# Altium schematic sheet Sheet1.SchDoc (part 2 of 3)
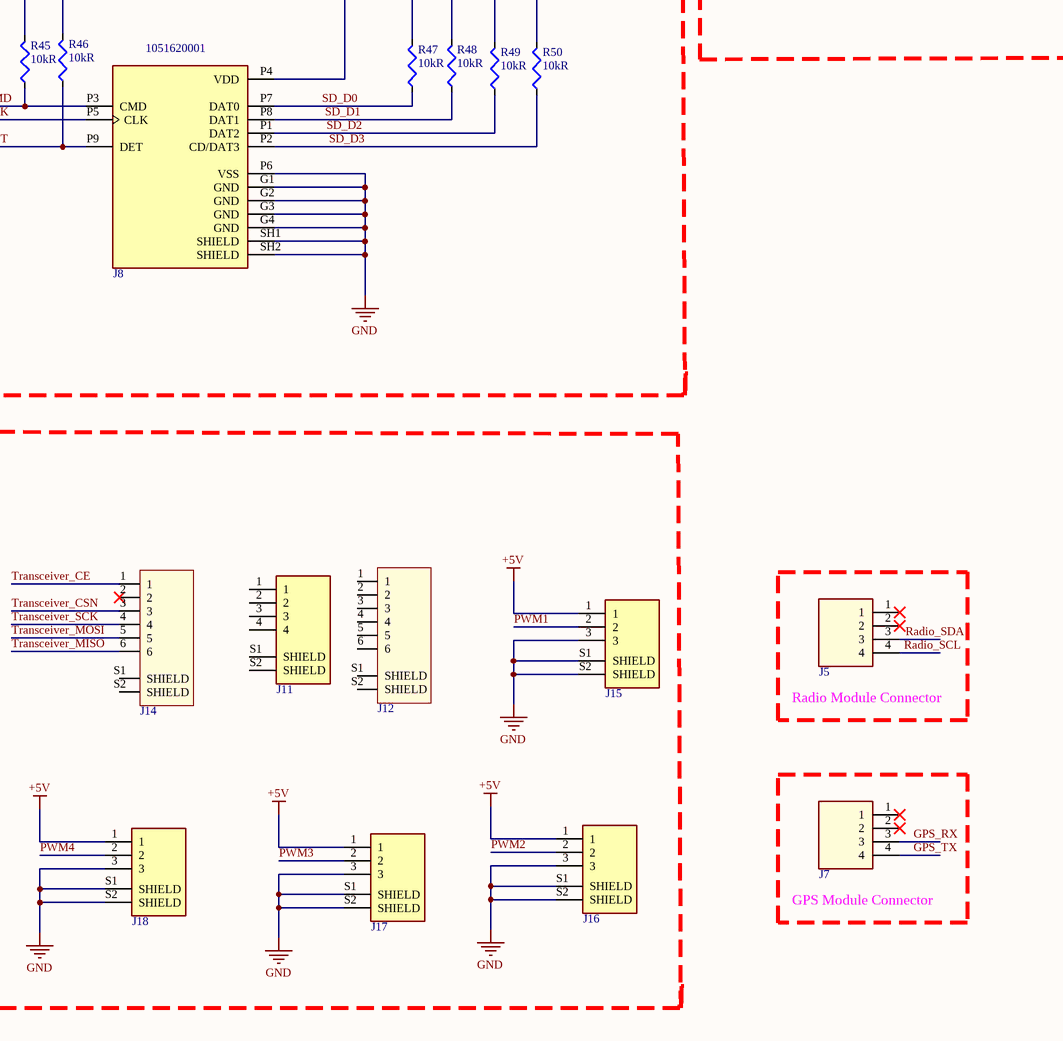
[diagram p4: Sheet1.SchDoc, bottom right]
## Library data of the parts
C1 C3 C29 C30 C52 C53 C64 = GRM155R71H103MA88D: Cap Ceramic 0.01uF 50V X7R 20% SMD 0402 125°C Paper T/R; Manufacturer: Murata; Supplier: Mouser; Supplier Part Number: 81-GRM155R71H103MA8D; Manufacturer Part Number: GRM155R71H103MA88D; RoHS: Yes; Category: Ceramic Capacitors; Stock: 64523; Pricing: 1=0.10000, 10=0.01200, 50=0.01200, 100=0.01000, 1000=0.00600, 10000=0.00400 (USD); Mounting Technology: Surface Mount; Case/Package: 0402; Min Operating Temperature: -55°C; Max Operating Temperature: 125°C; Tolerance: 20%; Packaging: Tape and Reel; Dielectric: X7R; Voltage Rating (DC): 50V; Construction: Flat; Length: 1mm; Width: 500um; Height: 0.5mm; Depth: 0.5mm; Thickness: 500um; Radiation Hardening: No; RoHS Compliant: Yes; ComponentLink1URL: https://datasheet.ciiva.com/11619/product-11619919.pdf?src-supplier=Avnet; ComponentLink1Description: https://datasheet.ciiva.com/11619/product-11619919.pdf?src-supplier=Avnet
C2 C7 C9 C27 C28 C31 C33 C37 C39 C44 C54 C55 = GCM155L81E104KE02D: 0402 0.1 uF 25 V ±10% Tolerance X8L Surface Mount Multilayer Ceramic Capacitor; Manufacturer: Murata; Supplier: Digi-Key; Supplier Part Number: 490-18203-6-ND; Manufacturer Part Number: GCM155L81E104KE02D; RoHS: Yes; Category: Ceramic Capacitors; Stock: 32810; Pricing: 1=0.10000, 10=0.04000, 50=0.02180, 100=0.01780, 500=0.01272, 1000=0.01000, 2500=0.00909, 5000=0.00836 (USD); RoHS Compliant: Yes; ComponentLink1URL: https://psearch.en.murata.com/capacitor/product/GCM155L81E104KE02%23.pdf?src-supplier=Digi-Key; ComponentLink1Description: https://psearch.en.murata.com/capacitor/product/GCM155L81E104KE02%23.pdf?src-supplier=Digi-Key; Case/Package: 0402
C4 C25 C26 C56 C57 = GRM152R60J105ME15D: Multilayer Ceramic Capacitor, 1 uF, 6.3 V, ± 20%, X5R, 0402 [1005 Metric]; Manufacturer: Murata; Material: 4241ConductorMaterial; Supplier: Mouser; Supplier Part Number: 81-GRM152R60J105ME5D; Manufacturer Part Number: GRM152R60J105ME15D; RoHS: Yes; Category: Ceramic Capacitors; Stock: 134223; Pricing: 1=0.2, 10=0.085, 50=0.085, 100=0.051, 1000=0.043, 10000=0.036 (USD); Height: 220um; ComponentLink1URL: http://search.murata.co.jp/Ceramy/image/img/A01X/G101/ENG/GRM152R60J105ME15-01.pdf?src-supplier=Digikey; ComponentLink1Description: http://search.murata.co.jp/Ceramy/image/img/A01X/G101/ENG/GRM152R60J105ME15-01.pdf?src-supplier=Digikey; ComponentLink2URL: https://datasheet.octopart.com/GRM152R60J105ME15D-Murata-datasheet-149522820.pdf?src-supplier=Newark; ComponentLink2Description: https://datasheet.octopart.com/GRM152R60J105ME15D-Murata-datasheet-149522820.pdf?src-supplier=Newark; ComponentLink3URL: https://datasheet.octopart.com/GRM152R60J105ME15D-Murata-datasheet-32479577.pdf?src-supplier=Future+Electronics; ComponentLink3Description: https://datasheet.octopart.com/GRM152R60J105ME15D-Murata-datasheet-32479577.pdf?src-supplier=Future+Electronics; Case/Package: 0402
C5 C6 = GCM1885C2A100JA16J: Multilayer Ceramic Capacitor, 10 pF, 100 V, ± 5%, C0G (NP0), 0603 [1608 Metric]; Manufacturer: Murata; Material: 4241ConductorMaterial; Voltage Rating: 100V; Temperature Coefficient: 30ppm/°C; Supplier: Mouser; Supplier Part Number: 81-GCM1885C2A100JA6J; Manufacturer Part Number: GCM1885C2A100JA16J; RoHS: Yes; Category: Ceramic Capacitors; Stock: 22276; Pricing: 1=0.1, 10=0.045, 50=0.045, 100=0.026, 1000=0.02, 10000=0.014 (USD); Mounting Technology: Surface Mount; Case/Package: 0603; Case Code (Imperial): 0603; Case Code (Metric): 1608; Min Operating Temperature: -55°C; Max Operating Temperature: 125°C; Package Quantity: 10000; Tolerance: 5%; Packaging: Tape and Reel; Dielectric: C0G; Termination: SMD/SMT; Voltage Rating (DC): 100V; Series: GCM; Construction: Flat; Length: 1.6mm; Width: 800um; Height: 0.8mm; Depth: 0.8mm; Thickness: 800um; Radiation Hardening: No; RoHS Compliant: Yes; ComponentLink1URL: https://datasheet.ciiva.com/11607/product-11607387.pdf?src-supplier=Avnet; ComponentLink1Description: https://datasheet.ciiva.com/11607/product-11607387.pdf?src-supplier=Avnet
C8 C11 C15 C17 C19 C21 = GMC02X7R104K10NT: Ceramic Capacitor, Multilayer, Ceramic, 10V, 10% +Tol, 10% -Tol, X7R, 15% TC, 0.1uF, Surface Mount, 0201; Manufacturer: Cal-Chip Electronics; Supplier: DigiKey; Supplier Part Number: 4713-GMC02X7R104K10NTCT-ND; Manufacturer Part Number: GMC02X7R104K10NT; RoHS: Compliant; Category: Ceramic Capacitors; Stock: 1793015; Pricing: 1=0.1, 10=0.028, 50=0.0186, 100=0.0158, 500=0.0112, 1000=0.00978, 2500=0.0083, 5000=0.00741 (USD); China RoHS: Compliant; Dielectric Material: Ceramic; Height: 330µm; Length: 600µm; Lifecycle Status: Production; Max Operating Temperature: 125°C; Min Operating Temperature: -55°C; Mounting Technology: Surface Mount; Number of Terminals: 2; REACH SVHC: Yes; Voltage Rating (DC): 10V; Width: 300µm; ComponentLink1URL: https://datasheet.octopart.com:443/GMC02X7R104K10NT-Cal-Chip-Electronics-datasheet-182028815.pdf?src-supplier=IHS; ComponentLink1Description: https://datasheet.octopart.com:443/GMC02X7R104K10NT-Cal-Chip-Electronics-datasheet-182028815.pdf?src-supplier=IHS; Case/Package: 0201
C10 C20 C22 = GRM155R61A106ME11D: Multilayer Ceramic Capacitor, 10 uF, 10 V, ± 20%, X5R, 0402 [1005 Metric]; Manufacturer: Murata; Supplier: Digi-Key; Supplier Part Number: 490-GRM155R61A106ME11DCT-ND; Manufacturer Part Number: GRM155R61A106ME11D; RoHS: Yes; Category: Ceramic Capacitors; Stock: 37673; Pricing: 1=0.12, 10=0.084, 50=0.0478, 100=0.0396, 500=0.02776, 1000=0.02298, 2500=0.02138, 5000=0.01956 (USD); ComponentLink1URL: https://datasheet.octopart.com/GRM155R61A106ME11D-Murata-datasheet-155239053.pdf?src-supplier=Element14; ComponentLink1Description: https://datasheet.octopart.com/GRM155R61A106ME11D-Murata-datasheet-155239053.pdf?src-supplier=Element14; ComponentLink2URL: https://datasheet.octopart.com/GRM155R61A106ME11D-Murata-datasheet-165579666.pdf?src-supplier=TME; ComponentLink2Description: https://datasheet.octopart.com/GRM155R61A106ME11D-Murata-datasheet-165579666.pdf?src-supplier=TME; Case/Package: 0402
C12 = GRM31CR60E227ME11L: 220 µF ±20% 2.5V Ceramic Capacitor X5R 1206 (3216 Metric); Manufacturer Part Number: GRM31CR60E227ME11L
C13 C16 C60 C61 = GCM1555C1H220FA16J: Cap Ceramic 22pF 50V C0G 1% Pad SMD 0402 125C Automotive T/R; Manufacturer: Murata; Material: 4241ConductorMaterial; Temperature Coefficient: 30ppm/°C; Supplier: Mouser; Supplier Part Number: 81-GCM1555C1H220FA6J; Manufacturer Part Number: GCM1555C1H220FA16J; RoHS: Yes; Category: Ceramic Capacitors; Stock: 64515; Pricing: 1=0.1, 10=0.034, 50=0.034, 100=0.022, 1000=0.018, 10000=0.013 (USD); Case/Package: 0402; Min Operating Temperature: -55°C; Max Operating Temperature: 125°C; Voltage Rating: 50V; Length: 1mm; Width: 500um; Height: 550um; Thickness: 500um; RoHS Compliant: Yes
C14 = GCM155R71C333KA37D: 0402 16 V 0.033 uF ±10% Tolerance X7R Multilayer Ceramic Capacitor; Manufacturer: Murata; Material: 4241ConductorMaterial; Supplier: Mouser; Supplier Part Number: 81-GCM155R71C333KA7D; Manufacturer Part Number: GCM155R71C333KA37D; RoHS: Yes; Category: Ceramic Capacitors; Stock: 56799; Pricing: 1=0.1, 10=0.016, 50=0.016, 100=0.01, 1000=0.008, 10000=0.007 (USD); ComponentLink1URL: https://datasheet.ciiva.com/11605/product-11605431.pdf?src-supplier=Avnet; ComponentLink1Description: https://datasheet.ciiva.com/11605/product-11605431.pdf?src-supplier=Avnet; ComponentLink2URL: https://datasheet.ciiva.com/164/s0717e-164239.pdf?src-supplier=Digikey; ComponentLink2Description: https://datasheet.ciiva.com/164/s0717e-164239.pdf?src-supplier=Digikey; Case/Package: 0402
C18 C23 C24 C58 C59 = GRM035R60J475ME15J: Multilayer Ceramic Capacitor, 4.7 uF, 6.3 V, ± 20%, X5R, 0201 [0603 Metric]; Manufacturer: Murata; Material: 4241ConductorMaterial; Dielectric: 1537DielectricType; Voltage Rating: 6.3V; Supplier: Avnet; Supplier Part Number: GRM035R60J475ME15J; Manufacturer Part Number: GRM035R60J475ME15J; RoHS: Yes; Category: Ceramic Capacitors; Stock: 50000; Pricing: 50000=0.03841 (USD); Case/Package: 0201; Min Operating Temperature: -55°C; Max Operating Temperature: 85°C; Tolerance: 20%; Voltage Rating (DC): 6.3V; Length: 600um; Width: 300um; Height: 550um; Thickness: 500um; RoHS Compliant: Yes; ComponentLink1URL: https://datasheet.octopart.com/GRM035R60J475ME15J-Murata-datasheet-165579666.pdf?src-supplier=TME; ComponentLink1Description: https://datasheet.octopart.com/GRM035R60J475ME15J-Murata-datasheet-165579666.pdf?src-supplier=TME
C32 C34-C36 C42 C43 = GRM21BR61A476ME15L: Multilayer Ceramic Capacitor, 47 uF, 10 V, ï¿½ 20%, X5R, 0805 [2012 Metric]; Manufacturer: Murata; Material: 4241ConductorMaterial; Voltage Rating: 10V; Dissipation Factor: 0.035%; Supplier: Farnell; Supplier Part Number: 2611939; Manufacturer Part Number: GRM21BR61A476ME15L; RoHS: Yes; Category: Ceramic Capacitors; Stock: 320783; Pricing: 5=0.389, 50=0.251, 250=0.234, 500=0.217, 1500=0.213 (EUR); Mounting Technology: Surface Mount; Case/Package: 0805; Case Code (Metric): 2012; Case Code (Imperial): 0805; Dielectric Material: Ceramic; Min Operating Temperature: -55°C; Max Operating Temperature: 85°C; Tolerance: 20%; Packaging: Cut Tape; Dielectric: X5R; Voltage: 10V; Termination: SMD/SMT; Voltage Rating (DC): 10V; Series: GRM; Length: 0.079inch; Width: 0.049inch; Height: 1.25mm; Thickness: 0.057inch; Depth: 1.25mm; Reach SVHC Compliant: No; Lead Free: Lead Free; RoHS Compliant: Yes; ComponentLink1URL: http://www.farnell.com/datasheets/2079183.pdf?src-supplier=Farnell; ComponentLink1Description: http://www.farnell.com/datasheets/2079183.pdf?src-supplier=Farnell; ComponentLink2URL: http://www.farnell.com/datasheets/2079183.pdf?src-supplier=Newark; ComponentLink2Description: http://www.farnell.com/datasheets/2079183.pdf?src-supplier=Newark; ComponentLink3URL: http://www.farnell.com/datasheets/2079183.pdf?src-supplier=Element14; ComponentLink3Description: http://www.farnell.com/datasheets/2079183.pdf?src-supplier=Element14; ComponentLink4URL: https://datasheet.octopart.com/GRM21BR61A476ME15L-Murata-datasheet-66077109.pdf?src-supplier=Element14; ComponentLink4Description: https://datasheet.octopart.com/GRM21BR61A476ME15L-Murata-datasheet-66077109.pdf?src-supplier=Element14; ComponentLink5URL: http://search.murata.co.jp/Ceramy/image/img/A01X/G101/ENG/GRM21BR61A476ME15-01.pdf?src-supplier=Digikey; ComponentLink5Description: http://search.murata.co.jp/Ceramy/image/img/A01X/G101/ENG/GRM21BR61A476ME15-01.pdf?src-supplier=Digikey; ComponentLink6URL: https://search.murata.co.jp/Ceramy/image/img/A01X/G101/ENG/GRM21BR61A476ME15-01.pdf?src-supplier=Digikey; ComponentLink6Description: https://search.murata.co.jp/Ceramy/image/img/A01X/G101/ENG/GRM21BR61A476ME15-01.pdf?src-supplier=Digikey; ComponentLink7URL: http://psearch.en.murata.com/capacitor/product/GRM21BR61A476ME15%23.pdf?src-supplier=Avnet; ComponentLink7Description: http://psearch.en.murata.com/capacitor/product/GRM21BR61A476ME15%23.pdf?src-supplier=Avnet
C38 C40 C45 = GRM188C81A106MA73D: 10V 10uF X6S ±20% 0603 Multilayer Ceramic Capacitors MLCC - SMD/SMT ROHS; Manufacturer: Murata; Manufacturer Lifecycle Status: IN PRODUCTION; Supplier: Arrow Electronics; Supplier Part Number: GRM188C81A106MA73D; Manufacturer Part Number: GRM188C81A106MA73D; RoHS: Compliant; Category: Ceramic Capacitors; Stock: 15369; Pricing: 1642=0.0461, 3000=0.045, 6000=0.045, 15000=0.044 (USD); Case/Package: 0603; Case Code (Imperial): 0603; Case Code (Metric): 1608; Dielectric: X6S; Dielectric Material: Ceramic; Height: 800µm; Lead Free: Lead Free; Length: 1.6mm; Lifecycle Status: Production; Material: Ceramic; Max Operating Temperature: 105°C; Min Operating Temperature: -55°C; Mounting Technology: Surface Mount; Number of Terminals: 2; REACH SVHC: Yes; Schedule B: 8532240020, 8532240020|8532240020, 8532240020|8532240020|8532240020, 8532240020|8532240020|8532240020|8532240020; Thickness: 800µm; Tolerance: 20%; Voltage Rating: 10V; Voltage Rating (DC): 10V; Width: 800µm; ComponentLink1URL: https://datasheet.octopart.com:443/GRM188C81A106MA73D-Murata-datasheet-141274651.pdf?src-supplier=Future+Electronics; ComponentLink1Description: https://datasheet.octopart.com:443/GRM188C81A106MA73D-Murata-datasheet-141274651.pdf?src-supplier=Future+Electronics; ComponentLink2URL: https://datasheet.octopart.com:443/GRM188C81A106MA73D-Murata-datasheet-96971104.pdf?src-supplier=Future+Electronics; ComponentLink2Description: https://datasheet.octopart.com:443/GRM188C81A106MA73D-Murata-datasheet-96971104.pdf?src-supplier=Future+Electronics; ComponentLink3URL: https://datasheet.octopart.com:443/GRM188C81A106MA73D-Murata-datasheet-22122223.pdf?src-supplier=Future+Electronics; ComponentLink3Description: https://datasheet.octopart.com:443/GRM188C81A106MA73D-Murata-datasheet-22122223.pdf?src-supplier=Future+Electronics; ComponentLink4URL: https://datasheet.octopart.com:443/GRM188C81A106MA73D-Murata-datasheet-149523171.pdf?src-supplier=Farnell; ComponentLink4Description: https://datasheet.octopart.com:443/GRM188C81A106MA73D-Murata-datasheet-149523171.pdf?src-supplier=Farnell; ComponentLink5URL: https://datasheet.octopart.com:443/GRM188C81A106MA73D-Murata-datasheet-66077086.pdf?src-supplier=element14+APAC; ComponentLink5Description: https://datasheet.octopart.com:443/GRM188C81A106MA73D-Murata-datasheet-66077086.pdf?src-supplier=element14+APAC; ComponentLink6URL: https://datasheet.octopart.com:443/GRM188C81A106MA73D-Murata-datasheet-165579666.pdf?src-supplier=TME; ComponentLink6Description: https://datasheet.octopart.com:443/GRM188C81A106MA73D-Murata-datasheet-165579666.pdf?src-supplier=TME; ComponentLink7URL: https://datasheet.octopart.com:443/GRM188C81A106MA73D-Murata-datasheet-140703321.pdf?src-supplier=Ciiva; ComponentLink7Description: https://datasheet.octopart.com:443/GRM188C81A106MA73D-Murata-datasheet-140703321.pdf?src-supplier=Ciiva; ComponentLink8URL: https://datasheet.octopart.com:443/GRM188C81A106MA73D-Murata-datasheet-138742663.pdf?src-supplier=Ciiva; ComponentLink8Description: https://datasheet.octopart.com:443/GRM188C81A106MA73D-Murata-datasheet-138742663.pdf?src-supplier=Ciiva; ComponentLink9URL: https://datasheet.octopart.com/GRM188C81A106MA73D-Murata-datasheet-12515295.pdf; ComponentLink9Description: https://datasheet.octopart.com/GRM188C81A106MA73D-Murata-datasheet-12515295.pdf; ComponentLink10URL: https://datasheet.octopart.com/GRM188C81A106MA73D-Murata-datasheet-12510076.pdf; ComponentLink10Description: https://datasheet.octopart.com/GRM188C81A106MA73D-Murata-datasheet-12510076.pdf; ComponentLink11URL: https://datasheet.octopart.com/GRM188C81A106MA73D-Murata-datasheet-11978611.pdf; ComponentLink11Description: https://datasheet.octopart.com/GRM188C81A106MA73D-Murata-datasheet-11978611.pdf; ComponentLink12URL: https://datasheet.octopart.com/GRM188C81A106MA73D-Murata-datasheet-10025737.pdf; ComponentLink12Description: https://datasheet.octopart.com/GRM188C81A106MA73D-Murata-datasheet-10025737.pdf; ComponentLink13URL: https://datasheet.octopart.com/GRM188C81A106MA73D-Murata-datasheet-8819587.pdf; ComponentLink13Description: https://datasheet.octopart.com/GRM188C81A106MA73D-Murata-datasheet-8819587.pdf; ComponentLink14URL: https://datasheet.octopart.com/GRM188C81A106MA73D-Murata-datasheet-14400899.pdf; ComponentLink14Description: https://datasheet.octopart.com/GRM188C81A106MA73D-Murata-datasheet-14400899.pdf; ComponentLink15URL: http://sigma.octopart.com:80/reach_statement/Murata-company-16.pdf?src-supplier=Compliance+Statements; ComponentLink15Description: http://sigma.octopart.com:80/reach_statement/Murata-company-16.pdf?src-supplier=Compliance+Statements
C41 C46 C48 = C1005NP02A101J050BA: Cap Ceramic 100pF 100V C0G 5% SMD 0402 150°C Punched Paper T/R; Manufacturer: TDK; Supplier: Digi-Key; Supplier Part Number: 445-C1005NP02A101J050BACT-ND; Manufacturer Part Number: C1005NP02A101J050BA; RoHS: Yes; Category: Ceramic Capacitors; Stock: 3231; Pricing: 1=0.14000, 10=0.10300, 50=0.05840, 100=0.04830, 500=0.03388, 1000=0.02805, 2500=0.02611, 5000=0.02389 (USD); Mounting Technology: Surface Mount; Case/Package: 0402; Case Code (Imperial): 0402; Case Code (Metric): 1005; Weight: 2.3E-05oz; Min Operating Temperature: -55°C; Max Operating Temperature: 150°C; Packaging: Tape and Reel; Voltage Rating: 100V; Tolerance: 5%; Dielectric: C0G; Termination: SMD/SMT; Voltage Rating (DC): 100V; Package Quantity: 10000; Features: High Temperature; Length: 0.039inch; Width: 0.02inch; Height: 0.5mm; Thickness: 0.022inch; RoHS Compliant: Yes; ComponentLink1URL: http://www.mouser.com/ds/2/400/mlcc_commercial_hightemp_en-348760.pdf?src-supplier=Mouser; ComponentLink1Description: http://www.mouser.com/ds/2/400/mlcc_commercial_hightemp_en-348760.pdf?src-supplier=Mouser; ComponentLink2URL: https://product.tdk.com/en/products/common/pdf/mlcc_partnumber_description.pdf?src-supplier=Digi-Key; ComponentLink2Description: https://product.tdk.com/en/products/common/pdf/mlcc_partnumber_description.pdf?src-supplier=Digi-Key; ComponentLink3URL: http://product.tdk.com/capacitor/mlcc/class/print_detail_pdf.php?lang=en&part_no=C1005NP02A101J050BA&src-supplier=Avnet; ComponentLink3Description: http://product.tdk.com/capacitor/mlcc/class/print_detail_pdf.php?lang=en&part_no=C1005NP02A101J050BA&src-supplier=Avnet
C47 C49 C51 = CGA2B2X5R1E103M050BA: Cap Ceramic 0.01uF 25V X5R 20% SMD 0402 85°C Punched Paper T/R; Manufacturer: TDK; Supplier: Digi-Key; Supplier Part Number: 445-12174-1-ND; Manufacturer Part Number: CGA2B2X5R1E103M050BA; RoHS: Yes; Category: Ceramic Capacitors; Stock: 528323; Pricing: 1=0.10000, 10=0.03400, 50=0.01880, 100=0.01530, 500=0.01096, 1000=0.00861, 2500=0.00783, 5000=0.00720 (USD); Mounting Technology: Surface Mount; Case/Package: 0402; Case Code (Metric): 1005; Case Code (Imperial): 0402; Weight: 2.3E-05oz; Min Operating Temperature: -55°C; Max Operating Temperature: 85°C; Package Quantity: 10000; Packaging: Tape and Reel; Tolerance: 20%; Voltage Rating: 25V; Dielectric: X5R; Voltage Rating (DC): 25V; Series: CGA; Length: 0.039inch; Width: 0.5mm; Height: 0.5mm; Thickness: 0.022inch; Ratings: AEC-Q200; RoHS Compliant: Yes; ComponentLink1URL: http://www.mouser.com/ds/2/400/lcc_automotive_general_en-843974.pdf?src-supplier=Mouser; ComponentLink1Description: http://www.mouser.com/ds/2/400/lcc_automotive_general_en-843974.pdf?src-supplier=Mouser; ComponentLink2URL: https://product.tdk.com/info/en/catalog/datasheets/mlcc_automotive_general_en.pdf?src-supplier=Digi-Key; ComponentLink2Description: https://product.tdk.com/info/en/catalog/datasheets/mlcc_automotive_general_en.pdf?src-supplier=Digi-Key; ComponentLink3URL: http://product.tdk.com/en/catalog/datasheets/mlcc_automotive_general_en.pdf?src-supplier=Avnet; ComponentLink3Description: http://product.tdk.com/en/catalog/datasheets/mlcc_automotive_general_en.pdf?src-supplier=Avnet
C65 = GCM155R71H102KA37D: Multilayer Ceramic Capacitor, 1000 pF, 50 V, ± 10%, X7R, 0402 [1005 Metric]; Manufacturer: Murata; Material: 4241ConductorMaterial; Voltage Rating: 50V; Supplier: Rs; Supplier Part Number: 7234950P; Manufacturer Part Number: GCM155R71H102KA37D; RoHS: Yes; Category: Ceramic Capacitors; Stock: 9800; Pricing: 400=1.045, 4000=0.675, 6000=0.495, 8000=0.31 (JPY); Mounting Technology: Surface Mount; Case/Package: 0402; Case Code (Metric): 1005; Case Code (Imperial): 0402; Min Operating Temperature: -55°C; Max Operating Temperature: 125°C; Package Quantity: 1; Tolerance: 10%; Packaging: Tape and Reel; Voltage Rating (DC): 50V; Dielectric: X7R; Termination: SMD/SMT; Voltage: 50V; Series: GCM; Construction: Flat; Length: 1mm; Width: 0.02inch; Height: 0.5mm; Thickness: 0.022inch; Depth: 0.5mm; Ratings: AEC-Q200; Radiation Hardening: No; Reach SVHC Compliant: No; Lead Free: Lead Free; RoHS Compliant: Yes; ComponentLink1URL: https://datasheet.ciiva.com/11786/0900766b80ef92d0-11786143.pdf?src-supplier=Rs; ComponentLink1Description: https://datasheet.ciiva.com/11786/0900766b80ef92d0-11786143.pdf?src-supplier=Rs; ComponentLink2URL: https://datasheet.ciiva.com/16213/product-16213384.pdf?src-supplier=Future+Electronics; ComponentLink2Description: https://datasheet.ciiva.com/16213/product-16213384.pdf?src-supplier=Future+Electronics
C66 = CGA1A2C0G1E1R5C030BA: 1.5 pF ±0.25pF 25V Ceramic Capacitor C0G, NP0 0201 (0603 Metric); Manufacturer Part Number: CGA1A2C0G1E1R5C030BA
C67 = GJM1555C1H1R0WB01D: 0402 50 V 1 pF ±0.05 pF Tolerance C0G Multilayer Ceramic Capacitor; Manufacturer Part Number: GJM1555C1H1R0WB01D
C68 = GCM155R71H222KA37D: Multilayer Ceramic Capacitor, 2200 pF, 50 V, ± 10%, X7R, 0402 [1005 Metric]; Manufacturer: Murata; Material: 4241ConductorMaterial; Voltage Rating: 50V; Supplier: Future Electronics; Supplier Part Number: 7052250; Manufacturer Part Number: GCM155R71H222KA37D; RoHS: Yes; Category: Ceramic Capacitors; Stock: 80000; Pricing: 10000=0.0029, 40000=0.0027, 150000=0.0026, 250000=0.0025, 500000=0.0024 (USD); Mounting Technology: Surface Mount; Case/Package: 0402; Case Code (Metric): 1005; Case Code (Imperial): 0402; Weight: 2.3E-05oz; Min Operating Temperature: -55°C; Max Operating Temperature: 125°C; Packaging: Tape and Reel; Tolerance: 10%; Package Quantity: 1; Voltage Rating (DC): 50V; Dielectric: X7R; Termination: SMD/SMT; Voltage: 50V; Series: GCM; Construction: Flat; Length: 1mm; Width: 0.02inch; Height: 0.5mm; Thickness: 0.022inch; Depth: 0.5mm; Ratings: AEC-Q200; Radiation Hardening: No; RoHS Compliant: Yes; Lead Free: 5697LeadFree; ComponentLink1URL: https://datasheet.ciiva.com/130/product-130809.pdf?src-supplier=Digikey; ComponentLink1Description: https://datasheet.ciiva.com/130/product-130809.pdf?src-supplier=Digikey; ComponentLink2URL: https://datasheet.ciiva.com/130/product-130808.pdf?src-supplier=Digikey; ComponentLink2Description: https://datasheet.ciiva.com/130/product-130808.pdf?src-supplier=Digikey; ComponentLink3URL: https://datasheet.ciiva.com/130/product-130810.pdf?src-supplier=Digikey; ComponentLink3Description: https://datasheet.ciiva.com/130/product-130810.pdf?src-supplier=Digikey; ComponentLink4URL: https://datasheet.ciiva.com/11620/product-11620577.pdf?src-supplier=Avnet; ComponentLink4Description: https://datasheet.ciiva.com/11620/product-11620577.pdf?src-supplier=Avnet; ComponentLink5URL: https://datasheet.ciiva.com/26889/getdatasheetpartid-692458-26889132.pdf?src-supplier=Verical; ComponentLink5Description: https://datasheet.ciiva.com/26889/getdatasheetpartid-692458-26889132.pdf?src-supplier=Verical
C69 = GRM0335C1E4R7CD01D: 4.7 pF ±0.25pF 25V Ceramic Capacitor C0G, NP0 0201 (0603 Metric); Manufacturer Part Number: GRM0335C1E4R7CD01D
D1 = LTST-S270KGKT: LED GREEN CLEAR 0603 R/A SMD; Manufacturer: Vishay Lite-On; Lens Color: Colorless; Forward Current: 30mA; Forward Voltage: 2V; Power Rating: 75mW; Luminous Intensity: 71mcd; Viewing Angle: 130°; Lens Style: Diffused,Colorless,Rectangular,Clear; Dominant Wavelength: 571nm; Test Current: 20mA; Number of Elements: 1; Wavelength: 574nm; Reverse Voltage: 5V; Supplier: Rs; Supplier Part Number: 6921219P; Manufacturer Part Number: LTST-S270KGKT; RoHS: Yes; Category: LEDs; Stock: 35150; Pricing: 250=0.06300, 500=0.05900, 1250=0.03700, 2500=0.03500 (GBP); Mounting Technology: Surface Mount; Case/Package: 0603; Pins: 2; Color: Green; Case Code (Metric): 1608; Case Code (Imperial): 0603; Min Operating Temperature: -55°C; Max Operating Temperature: 85°C; Illumination Color: Green; Packaging: Tape and Reel; Package Quantity: 1; Lens Transparency: Clear; Power Dissipation: 75mW; Number of LEDs: 1; Length: 1.6mm; Width: 1.15mm; Height: 0.6mm; Depth: 0.6mm; Radiation Hardening: No; Lead Free: Lead Free; RoHS Compliant: Yes; ComponentLink1URL: https://datasheet.ciiva.com/2110/ltst-s270kgkt-2110006.pdf?src-supplier=Digi-Key; ComponentLink1Description: https://datasheet.ciiva.com/2110/ltst-s270kgkt-2110006.pdf?src-supplier=Digi-Key; ComponentLink2URL: https://datasheet.ciiva.com/12400/ltst-s270kgkt-201847-12400865.pdf?src-supplier=Mouser; ComponentLink2Description: https://datasheet.ciiva.com/12400/ltst-s270kgkt-201847-12400865.pdf?src-supplier=Mouser; ComponentLink3URL: https://datasheet.ciiva.com/4266/dwonloadfilehandler-ashxtxtspecnods222000226-4266440.pdf?src-supplier=Arrow+Electronics; ComponentLink3Description: https://datasheet.ciiva.com/4266/dwonloadfilehandler-ashxtxtspecnods222000226-4266440.pdf?src-supplier=Arrow+Electronics; ComponentLink4URL: https://datasheet.ciiva.com/11774/0900766b80dc0b88-11774745.pdf?src-supplier=Rs; ComponentLink4Description: https://datasheet.ciiva.com/11774/0900766b80dc0b88-11774745.pdf?src-supplier=Rs; ComponentLink5URL: https://datasheet.ciiva.com/2110/s-110-ltst-s270kgkt-2110007.pdf?src-supplier=Digi-Key; ComponentLink5Description: https://datasheet.ciiva.com/2110/s-110-ltst-s270kgkt-2110007.pdf?src-supplier=Digi-Key; ComponentLink6URL: https://datasheet.ciiva.com/2110/s-110-ltst-s270kgkt-2110008.pdf?src-supplier=Digi-Key; ComponentLink6Description: https://datasheet.ciiva.com/2110/s-110-ltst-s270kgkt-2110008.pdf?src-supplier=Digi-Key; ComponentLink7URL: https://datasheet.ciiva.com/16448/ltst-s270kgkt-16448566.pdf?src-supplier=Future+Electronics; ComponentLink7Description: https://datasheet.ciiva.com/16448/ltst-s270kgkt-16448566.pdf?src-supplier=Future+Electronics
D2 D3 = SMF30A: Diode TVS Single Uni-Dir 30V 200W 2-Pin SOD-123F T/R; Manufacturer: Littelfuse; Peak Pulse Current: 4.1A; Number of Unidirectional Channels: 1; Min Breakdown Voltage: 33.3V; Power Line Protection: No; Diode Type: ZENER; Clamping Voltage: 48.4V; Breakdown Voltage: 36.8V; Polarity: Unidirectional; Supplier: Future Electronics; Supplier Part Number: 4083400; Manufacturer Part Number: SMF30A; RoHS: Yes; Category: TVS Diodes; Stock: 75000; Pricing: 3000=0.0941, 9000=0.0905, 15000=0.0889, 30000=0.0867, 60000=0.0834 (USD); Mounting Technology: Surface Mount; Pins: 2; Min Operating Temperature: -55°C; Max Operating Temperature: 150°C; Packaging: Tape and Reel; Reverse Standoff Voltage: 30V; Peak Pulse Power: 200W; Series: SMF; Number of Channels: 1; Max Surge Current: 4.1A; Termination: SMD/SMT; Max Breakdown Voltage: 36.8V; RoHS Compliant: Yes; Lead Free: Lead Free; Reach SVHC Compliant: Unknown; ComponentLink1URL: https://datasheet.ciiva.com/6578/littelfuse-tvs-diode-smf-datasheet-pdf-6578351.pdf?src-supplier=Digi-Key; ComponentLink1Description: https://datasheet.ciiva.com/6578/littelfuse-tvs-diode-smf-datasheet-pdf-6578351.pdf?src-supplier=Digi-Key
D4 = TDZ5V1J,115: Diode Zener Single 5.1V 2% 500mW Automotive 2-Pin SOD-323F T/R; Manufacturer: Nexperia; Supplier: Digi-Key; Supplier Part Number: 1727-1761-1-ND; Manufacturer Part Number: TDZ5V1J,115; RoHS: Yes; Category: Zener Diodes; Stock: 14899; Pricing: 1=0.34000, 10=0.28100, 100=0.14910, 500=0.09810, 1000=0.06671 (USD); RoHS Compliant: Yes; ComponentLink1URL: http://www.farnell.com/datasheets/1508366.pdf?src-supplier=Farnell; ComponentLink1Description: http://www.farnell.com/datasheets/1508366.pdf?src-supplier=Farnell; ComponentLink2URL: https://www.mouser.com/ds/2/302/TDZXJ_SER-119854.pdf?src-supplier=Mouser; ComponentLink2Description: https://www.mouser.com/ds/2/302/TDZXJ_SER-119854.pdf?src-supplier=Mouser; Value: 5.1V; Case/Package: SOD-323F
J1 = XT60PW-M: Socket, DC supply, male, PIN: 2; Manufacturer Part Number: XT60PW-M
J4 = USB4110GFA: USB-C (USB TYPE-C) USB 2.0 Receptacle Connector 24 (16+8 Dummy) Position Surface Mount, Right Angle; Manufacturer Part Number: USB4110GFA
J5 J7 = B4B-ZR(LF)(SN): Header for PCB; pitch 1.50mm; 4-contacts; THT; male; top entry; 50V/1A; Manufacturer: JST; Body Plating: Tin; Number of Positions: 4; Voltage Rating: 50V; Contact Resistance: 30mR; Current Rating: 1A; Insulation Resistance: 500MR; Pitch: 1.5mm; Panel Thickness: 3.5mm; Supplier: Future Electronics; Supplier Part Number: 4966537; Manufacturer Part Number: B4B-ZR(LF)(SN); RoHS: Yes; Category: Headers and Wire Housings; Stock: 657; Pricing: 1=0.1, 400=0.0957, 1250=0.0916, 2000=0.0908, 4000=0.0877, 8000=0.0861, 10000=0.0854, 12500=0.0803, 30000=0.081 (USD); Mounting Technology: Through Hole; Contact Plating: Tin,Copper; Contact Material: Brass,Tin,Copper; Color: Natural,White; Housing Color: Beige; Housing Material: Polyamide; Material: Nylon; Min Operating Temperature: -25°C; Max Operating Temperature: 85°C; Packaging: Bulk; Termination: Solder; Number of Rows: 1; Series: ZH; Number of Contacts: 4; Contact Type: Male Pin; Fastening Type: Detent; Orientation: Straight; Max Current Rating: 1A; Max Voltage Rating (AC): 50V; Voltage Rating (AC): 50V; Voltage Rating (DC): 50V; Length: 7.5mm; Depth: 3.5mm; Lead Pitch: 1.5mm; Contact Mating Length: 0.094inch; Lead Free: Lead Free; Flammability Rating: UL94 V-0; Reach SVHC Compliant: No; ComponentLink1URL: https://datasheet.ciiva.com/11752/0900766b8082f580-11752165.pdf?src-supplier=Rs; ComponentLink1Description: https://datasheet.ciiva.com/11752/0900766b8082f580-11752165.pdf?src-supplier=Rs; ComponentLink2URL: https://datasheet.ciiva.com/25616/0900766b81147f94-25616839.pdf?src-supplier=Rs; ComponentLink2Description: https://datasheet.ciiva.com/25616/0900766b81147f94-25616839.pdf?src-supplier=Rs; ComponentLink3URL: https://datasheet.ciiva.com/6747/80551-6747412.pdf?src-supplier=Newark; ComponentLink3Description: https://datasheet.ciiva.com/6747/80551-6747412.pdf?src-supplier=Newark; ComponentLink4URL: https://datasheet.ciiva.com/26894/getdatasheetpartid-731121-26894470.pdf?src-supplier=Verical; ComponentLink4Description: https://datasheet.ciiva.com/26894/getdatasheetpartid-731121-26894470.pdf?src-supplier=Verical; ComponentLink5URL: https://datasheet.ciiva.com/712/ezh-712479.pdf?src-supplier=Digikey; ComponentLink5Description: https://datasheet.ciiva.com/712/ezh-712479.pdf?src-supplier=Digikey; ComponentLink6URL: https://datasheet.ciiva.com/8052/80551-8052053.pdf?src-supplier=Element14; ComponentLink6Description: https://datasheet.ciiva.com/8052/80551-8052053.pdf?src-supplier=Element14; ComponentLink7URL: https://datasheet.ciiva.com/16207/ezr-16207223.pdf?src-supplier=Future+Electronics; ComponentLink7Description: https://datasheet.ciiva.com/16207/ezr-16207223.pdf?src-supplier=Future+Electronics
J6 J9 = 2337019-1: RF Connector; Coaxial Connectors MicroCoax receptacle UMCC Gen 1; Manufacturer: TE Connectivity; Body Material: Copper Alloy; Center Contact Plating: Gold; Dielectric Material: Thermoplastic; Connector Type: Receptacle,Male Pin; Impedance: 50R; Clock Frequency: 6GHz; Number of Ports: 1; Supplier: Rs; Supplier Part Number: 1888357; Manufacturer Part Number: 2337019-1; RoHS: Yes; Category: RF / Coaxial Connectors; Stock: 10300; Pricing: 10000=0.074, 30000=0.074 (GBP); Mounting Technology: Surface Mount; Contact Material: Copper Alloy; Min Operating Temperature: -40°C; Max Operating Temperature: 85°C; Series: -; Packaging: Cut Tape; Termination: Solder; ComponentLink1URL: https://www.te.com/commerce/DocumentDelivery/DDEController?Action=srchrtrv&amp;DocNm=C-2337019&amp;DocType=Customer+Drawing&amp;DocLang=English&src-supplier=Digi-Key; ComponentLink1Description: https://www.te.com/commerce/DocumentDelivery/DDEController?Action=srchrtrv&amp;DocNm=C-2337019&amp;DocType=Customer+Drawing&amp;DocLang=English&src-supplier=Digi-Key; ComponentLink2URL: https://datasheet.octopart.com/2337019-1-TE-Connectivity-datasheet-169146699.pdf?src-supplier=Sager+Electronics; ComponentLink2Description: https://datasheet.octopart.com/2337019-1-TE-Connectivity-datasheet-169146699.pdf?src-supplier=Sager+Electronics
J8 = 1051620001: Conn Micro SD Card HDR 8 POS 1.09mm Solder RA SMD 0.5A/Contact Embossed T/R; Manufacturer: Molex; Connector Type: Connector; Max Voltage Rating (DC): 5V; Number of Circuits: 8; Supplier 1: Digikey; Manufacturer Part Number: 1051620001; RoHS: Yes; Category: Memory Connectors; Stock 1: 43165; Pricing 1: 1=1.03, 10=0.852, 100=0.7098, 1000=0.56786 (USD); Mount: Surface Mount; Contact Material: Bronze; Contact Plating: Gold; Housing Material: Thermoplastic; Min Operating Temperature: -40°C; Max Operating Temperature: 85°C; Packaging: Tape and Reel; Number of Rows: 1; Termination: Solder; Orientation: Right Angle; Package Quantity: 6000; Series: 105162; Length: 11.3mm; Depth: 7.6mm; RoHS Compliant: Yes; ComponentLink1URL: https://datasheet.ciiva.com/29723/1051620101-sd-29723393.pdf?src-supplier=Digikey; ComponentLink1Description: https://datasheet.ciiva.com/29723/1051620101-sd-29723393.pdf?src-supplier=Digikey; Supplier Part Number 1: WM14405CT-ND
J10 = 20279-001E-03: 1 POS Vertical SMD Coaxial connector M.2 industry standard with a mated height of 1.4 mm and support up to 12 GHz MHF 4L Receptacle; Manufacturer Part Number: 20279-001E-03
J11 J13 = BM04B-GHS-TBT(LF)(SN)(N): Conn Shrouded Header HDR 4 POS 1.25mm Solder ST Top Entry SMD T/R; Manufacturer: JST; Supplier: Digi-Key; Supplier Part Number: 455-1580-1-ND; Manufacturer Part Number: BM04B-GHS-TBT(LF)(SN)(N); RoHS: Yes; Category: Headers and Wire Housings; Stock: 4992; Pricing: 1=0.50000, 10=0.42400, 100=0.32960, 500=0.28252, 1000=0.23544 (USD); ComponentLink1URL: http://www.jst-mfg.com/product/pdf/eng/eGH.pdf?src-supplier=Digi-Key; ComponentLink1Description: http://www.jst-mfg.com/product/pdf/eng/eGH.pdf?src-supplier=Digi-Key; ComponentLink2URL: http://www.jst-mfg.com/product/pdf/eng/eGH.pdf?src-supplier=Component+Distributors+Inc.; ComponentLink2Description: http://www.jst-mfg.com/product/pdf/eng/eGH.pdf?src-supplier=Component+Distributors+Inc.
J12 J14 = BM06B-GHS-TBT(LF)(SN)(N): Conn Shrouded Header (4 Sides) HDR 6 POS 1.25mm Solder ST Top Entry SMD T/R; Manufacturer: JST; Number of Positions: 6; Voltage Rating: 50V; Pitch: 0.049inch; Mated Stacking Heights: 7.3mm; Supplier: Digi-Key; Supplier Part Number: 455-1582-6-ND; Manufacturer Part Number: BM06B-GHS-TBT(LF)(SN)(N); RoHS: Yes; Category: Connectors; Pricing: 1=0.55, 10=0.482, 100=0.397, 500=0.34518, 1000=0.28477 (USD); Mounting Technology: Surface Mount; Color: Natural; Contact Plating: Tin; Contact Material: Bronze; Contact Shape: Rectangular; Contact Finish - Mating: TIN; Insulation Material: Nylon; Insulation Color: Natural; Min Operating Temperature: -25°C; Max Operating Temperature: 85°C; Number of Rows: 1; Fastening Type: Ramp; Packaging: Cut Tape; Termination: Solder; Connector Type: Header; Series: GH; Contact Type: Outer Shroud Contact; Lead Free: Lead Free; Flammability Rating: UL94 V-0; ComponentLink1URL: https://datasheet.ciiva.com/712/egh-712475.pdf?src-supplier=Digi-Key; ComponentLink1Description: https://datasheet.ciiva.com/712/egh-712475.pdf?src-supplier=Digi-Key; ComponentLink2URL: https://datasheet.ciiva.com/712/egh-712476.pdf?src-supplier=Digi-Key; ComponentLink2Description: https://datasheet.ciiva.com/712/egh-712476.pdf?src-supplier=Digi-Key; ComponentLink3URL: https://datasheet.ciiva.com/730/egh-730626.pdf?src-supplier=Digi-Key; ComponentLink3Description: https://datasheet.ciiva.com/730/egh-730626.pdf?src-supplier=Digi-Key
J15-J19 = BM03B-GHS-TBT(LF)(SN)(N): Connector Header, GH Series, 3 Position, 1.25mm, 50V, Surface Mount, Locking Ramp, Natural; Manufacturer: JST; Current Rating: 1A; Number of Contacts: 3NUMBER; Supplier: Arrow Electronics; Supplier Part Number: BM03B-GHS-TBT (LF)(SN)(N); Manufacturer Part Number: BM03B-GHS-TBT(LF)(SN)(N); RoHS: Yes; Category: Headers and Wire Housings; Stock: 5000; Pricing: 2500=0.352, 5000=0.3351, 10000=0.3244, 20000=0.3146, 25000=0.3041, 50000=0.2948 (USD); Orientation: 5495OrientationType; Height: 4.05mm; Lead Free: 5697LeadFree; ComponentLink1URL: https://datasheet.ciiva.com/730/egh-730628.pdf?src-supplier=Digikey; ComponentLink1Description: https://datasheet.ciiva.com/730/egh-730628.pdf?src-supplier=Digikey
L1-L3 = 74438356150: General Purpose Inductor, 15uH, 20%, 1 Element, SMD, 1616; Manufacturer: Wurth Electronics; Supplier: Farnell; Supplier Part Number: 2842179; Manufacturer Part Number: 74438356150; RoHS: Yes; Category: Fixed Inductors; Stock: 719; Pricing: 1=338.96, 50=322.98, 100=299, 250=276.61, 500=257.42, 1000=209.46, 5000=205.28, 10000=201.09 (JPY); ComponentLink1URL: http://www.farnell.com/datasheets/2579563.pdf?src-supplier=Farnell; ComponentLink1Description: http://www.farnell.com/datasheets/2579563.pdf?src-supplier=Farnell; ComponentLink2URL: http://www.farnell.com/datasheets/2579563.pdf?src-supplier=Element14; ComponentLink2Description: http://www.farnell.com/datasheets/2579563.pdf?src-supplier=Element14; ComponentLink3URL: https://katalog.we-online.de/pbs/datasheet/74438356150.pdf?src-supplier=Digikey; ComponentLink3Description: https://katalog.we-online.de/pbs/datasheet/74438356150.pdf?src-supplier=Digikey; ComponentLink4URL: http://www.farnell.com/datasheets/2579563.pdf?src-supplier=Newark; ComponentLink4Description: http://www.farnell.com/datasheets/2579563.pdf?src-supplier=Newark
L4 = LQW15AN2N7G8ZD: Inductor with Inductance: 2.7nH Tol. +/-2%, Package: 0402 (1005); Manufacturer Part Number: LQW15AN2N7G8ZD
L5 = LQW15AN8N2J00D: Inductor with Inductance: 8.2nH Tol. +/-5%, Package: 0402 (1005); Manufacturer Part Number: LQW15AN8N2J00D
L6 = LQP03TG3N9B02D: Inductor with Inductance: 3.9nH Tol. +/-0.1nH, Package: 0201 (0603); Manufacturer Part Number: LQP03TG3N9B02D
Q1-Q4 = BSS138: N-Channel 50 V 220mA (Tj) 430mW Surface Mount SOT-23; Manufacturer Part Number: BSS138
R1 = ERA-2ARB102X: Res Thin Film 0402 1K Ohm 0.1% 0.063W(1/16W) ±10ppm/C Pad SMD Automotive T/R; Manufacturer: Panasonic; Voltage Rating: 25V; Power Rating: 63mW; Temperature Coefficient: 10ppm/°C; Supplier: Mouser; Supplier Part Number: 667-ERA-2ARB102X; Manufacturer Part Number: ERA-2ARB102X; RoHS: No; Category: Chip SMD Resistors; Stock: 5741; Pricing: 1=0.73, 10=0.517, 50=0.396, 100=0.289, 1000=0.229, 10000=0.22 (USD); Case/Package: 0402; Case Code (Metric): 1005; Case Code (Imperial): 0402; Min Operating Temperature: -55°C; Max Operating Temperature: 155°C; Packaging: Cut Tape; Resistor Type: Thin Film; Number of Terminations: 2; Max Power Dissipation: 63mW; Features: Automotive AEC-Q200; Series: ERA-2A; Resistance Tolerance: 0.1%; Voltage Rating (DC): 25V; Length: 0.039inch; Width: 0.02inch; Height: 0.016inch; Ratings: AEC-Q200; Reach SVHC Compliant: No; Lead Free: 5697LeadFree; ComponentLink1URL: https://datasheet.ciiva.com/46422/1678789-46422459.pdf?src-supplier=Element14; ComponentLink1Description: https://datasheet.ciiva.com/46422/1678789-46422459.pdf?src-supplier=Element14; ComponentLink2URL: https://datasheet.ciiva.com/46422/1678789-46422460.pdf?src-supplier=Element14; ComponentLink2Description: https://datasheet.ciiva.com/46422/1678789-46422460.pdf?src-supplier=Element14
R2-R5 R8 R17 R41 R45-R50 = ERJ-2GEJ103X: Res Thick Film 0402 10K Ohm 5% 1/10W ±200ppm/°C Molded SMD Punched Carrier T/R; Manufacturer: Panasonic; Power Rating: 100mW; Voltage Rating: 50V; Supplier: Digi-Key; Supplier Part Number: P10KJCT-ND; Manufacturer Part Number: ERJ-2GEJ103X; RoHS: Yes; Category: Chip SMD Resistors; Stock: 10562994; Pricing: 1=0.10000, 10=0.02900, 100=0.01180, 1000=0.00532, 2500=0.00461, 5000=0.00381 (USD); Mounting Technology: Surface Mount; Case/Package: 0402; Contact Plating: Tin; Case Code (Metric): 1005; Case Code (Imperial): 0402; Min Operating Temperature: -55°C; Max Operating Temperature: 155°C; Tolerance: 5%; Temperature Coefficient: 200ppm/°C; Packaging: Cut Tape; Resistor Type: Thick Film; Package Quantity: 10000; Number of Terminations: 2; Termination: SMD/SMT; Max Power Dissipation: 100mW; Voltage Rating (DC): 50V; Features: Automotive AEC-Q200; Series: ERJ; Construction: Rectangular; Resistance Tolerance: 5%; Technology: THICK FILM; Length: 1mm; Width: 0.5mm; Height: 0.35mm; Depth: 0.5mm; Ratings: AEC-Q200; Radiation Hardening: No; Reach SVHC Compliant: Yes; Military Standard: Not; Lead Free: Lead Free; RoHS Compliant: Yes; ComponentLink1URL: https://datasheet.ciiva.com/27055/1935721-27055112.pdf?src-supplier=Jameco; ComponentLink1Description: https://datasheet.ciiva.com/27055/1935721-27055112.pdf?src-supplier=Jameco; ComponentLink2URL: https://datasheet.ciiva.com/11821/0900766b80f806dd-11821170.pdf?src-supplier=Rs; ComponentLink2Description: https://datasheet.ciiva.com/11821/0900766b80f806dd-11821170.pdf?src-supplier=Rs; ComponentLink3URL: https://datasheet.ciiva.com/24070/aoa0000ce1-37422-24070679.pdf?src-supplier=Mouser; ComponentLink3Description: https://datasheet.ciiva.com/24070/aoa0000ce1-37422-24070679.pdf?src-supplier=Mouser; ComponentLink4URL: https://datasheet.ciiva.com/16767/70260739-16767130.pdf?src-supplier=Allied+Electronics; ComponentLink4Description: https://datasheet.ciiva.com/16767/70260739-16767130.pdf?src-supplier=Allied+Electronics; ComponentLink5URL: https://datasheet.ciiva.com/9194/aoa0000ce1-9194140.pdf?src-supplier=Avnet; ComponentLink5Description: https://datasheet.ciiva.com/9194/aoa0000ce1-9194140.pdf?src-supplier=Avnet; ComponentLink6URL: https://datasheet.ciiva.com/43460/1678796-43460391.pdf?src-supplier=Farnell; ComponentLink6Description: https://datasheet.ciiva.com/43460/1678796-43460391.pdf?src-supplier=Farnell; ComponentLink7URL: https://datasheet.ciiva.com/22785/1678796-22785949.pdf?src-supplier=Farnell; ComponentLink7Description: https://datasheet.ciiva.com/22785/1678796-22785949.pdf?src-supplier=Farnell; ComponentLink8URL: https://datasheet.ciiva.com/46371/1678796-46371910.pdf?src-supplier=Element14; ComponentLink8Description: https://datasheet.ciiva.com/46371/1678796-46371910.pdf?src-supplier=Element14; ComponentLink9URL: https://datasheet.ciiva.com/28514/1678796-28514154.pdf?src-supplier=Element14; ComponentLink9Description: https://datasheet.ciiva.com/28514/1678796-28514154.pdf?src-supplier=Element14; ComponentLink10URL: https://datasheet.ciiva.com/16774/70260739-16774504.pdf?src-supplier=Allied+Electronics; ComponentLink10Description: https://datasheet.ciiva.com/16774/70260739-16774504.pdf?src-supplier=Allied+Electronics; ComponentLink11URL: https://datasheet.ciiva.com/48531/aoa0000ce1-48531082.pdf?src-supplier=Avnet; ComponentLink11Description: https://datasheet.ciiva.com/48531/aoa0000ce1-48531082.pdf?src-supplier=Avnet
R6 R7 R9 R10 R52-R55 = ERJ-1GNF4701C: SMD Chip Resistor, 4.7 kOhm, ï¿½ 1%, 50 mW, 0201 [0603 Metric], Thick Film, General Purpose; Manufacturer: Panasonic; Power Rating: 50mW; Voltage Rating: 25V; Temperature Coefficient: 200ppm/°C; Supplier: Rs; Supplier Part Number: 1797160; Manufacturer Part Number: ERJ-1GNF4701C; RoHS: Yes; Category: Chip SMD Resistors; Stock: 2000; Pricing: 1000=0.009, 5000=0.008, 10000=0.007 (EUR); Mounting Technology: Surface Mount; Case/Package: 0201; Pins: 2; Case Code (Imperial): 0201; Case Code (Metric): 0603; Contact Plating: Tin,Matte; Min Operating Temperature: -55°C; Max Operating Temperature: 125°C; Tolerance: 1%; Packaging: Tape and Reel; Package Quantity: 15000; Resistor Type: Thick Film; Number of Terminations: 2; Max Power Dissipation: 50mW; Working Voltage: 25V; Series: ERJ; Resistance Tolerance: 1%; Technology: THICK FILM; Features: Automotive AEC-Q200; Voltage Rating (DC): 25V; Length: 0.024inch; Width: 0.3mm; Height: 0.01inch; Ratings: AEC-Q200; RoHS Compliant: Yes; Reach SVHC Compliant: Unknown; Lead Free: 5697LeadFree; ComponentLink1URL: https://datasheet.ciiva.com/7830/1678782-7830714.pdf?src-supplier=Element14; ComponentLink1Description: https://datasheet.ciiva.com/7830/1678782-7830714.pdf?src-supplier=Element14; ComponentLink2URL: https://datasheet.ciiva.com/43467/1678782-43467070.pdf?src-supplier=Farnell; ComponentLink2Description: https://datasheet.ciiva.com/43467/1678782-43467070.pdf?src-supplier=Farnell; ComponentLink3URL: https://datasheet.ciiva.com/46375/1678782-46375115.pdf?src-supplier=Element14; ComponentLink3Description: https://datasheet.ciiva.com/46375/1678782-46375115.pdf?src-supplier=Element14; ComponentLink4URL: https://datasheet.ciiva.com/22743/1678782-22743082.pdf?src-supplier=Element14; ComponentLink4Description: https://datasheet.ciiva.com/22743/1678782-22743082.pdf?src-supplier=Element14; ComponentLink5URL: https://datasheet.ciiva.com/22743/1678782-22743083.pdf?src-supplier=Element14; ComponentLink5Description: https://datasheet.ciiva.com/22743/1678782-22743083.pdf?src-supplier=Element14; ComponentLink6URL: https://datasheet.ciiva.com/16201/aoa0000ce2-16201382.pdf?src-supplier=Future+Electronics; ComponentLink6Description: https://datasheet.ciiva.com/16201/aoa0000ce2-16201382.pdf?src-supplier=Future+Electronics
R11 R12 R16 = RT0402BRE0722K1L: High Precision-High Stability Chip Resistor Thin Film 0402 22.1kOhm 0.1% Paper T/R; Manufacturer: Yageo; Max Power Dissipation: 63mW; Temperature Coefficient: 50ppm/°C; Voltage Rating (DC): 50V; Supplier: Arrow Electronics; Supplier Part Number: RT0402BRE0722K1L; Manufacturer Part Number: RT0402BRE0722K1L; RoHS: Yes; Category: Chip SMD Resistors; Stock: 9703; Pricing: 1=0.0648, 10=0.0427, 25=0.0361, 100=0.033, 250=0.0327, 500=0.0303, 1000=0.0294, 3000=0.0285, 6000=0.0276 (USD); Case/Package: 0402; Case Code (Imperial): 0402; Min Operating Temperature: -55°C; Max Operating Temperature: 155°C; Package Quantity: 10000; Packaging: Tape and Reel; Tolerance: 0.1%; Number of Terminations: 2; Series: RT; Length: 0.039inch; Width: 0.02inch; Height: 0.014inch; Lead Free: Lead Free; RoHS Compliant: Yes; ComponentLink1URL: https://datasheet.ciiva.com/2582/pyu-rt-1-to-0-05-rohs-l-5-2582688.pdf?src-supplier=Digikey; ComponentLink1Description: https://datasheet.ciiva.com/2582/pyu-rt-1-to-0-05-rohs-l-5-2582688.pdf?src-supplier=Digikey
R13 R43 R44 = ERJ-2RKF1004X: RES SMD 1M OHM 1% 1/10W 0402; Manufacturer: Panasonic; Temperature Coefficient: 100ppm/°C; Power Rating: 100mW; Voltage Rating: 50V; Supplier Part Number: P1.00MLCT-ND; Manufacturer Part Number: ERJ-2RKF1004X; RoHS: Yes; Category: Chip SMD Resistors; Stock: 3168277; Pricing: 1=0.10000, 10=0.03400, 100=0.01390, 1000=0.00625, 2500=0.00543, 5000=0.00448 (USD); Mounting Technology: Surface Mount; Case/Package: 0402; Pins: 2; Contact Plating: Tin; Case Code (Metric): 1005; Case Code (Imperial): 0402; Weight: 2.8E-05oz; Min Operating Temperature: -55°C; Max Operating Temperature: 155°C; Tolerance: 1%; Resistor Type: Thick Film; Packaging: Tape and Reel; Package Quantity: 1; Number of Terminations: 2; Termination: SMD/SMT; Max Power Dissipation: 100mW; Voltage Rating (DC): 50V; Features: Automotive AEC-Q200; Working Voltage: 50V; Series: ERJ; Construction: Rectangular; Technology: THICK FILM; Resistance Tolerance: 1%; Length: 1mm; Width: 0.02inch; Height: 0.35mm; Depth: 0.5mm; Radiation Hardening: No; Lead Free: Lead Free; Reach SVHC Compliant: Yes; Military Standard: Not; RoHS Compliant: Yes; ComponentLink1URL: https://datasheet.ciiva.com/34303/1987046-34303551.pdf?src-supplier=Jameco; ComponentLink1Description: https://datasheet.ciiva.com/34303/1987046-34303551.pdf?src-supplier=Jameco; ComponentLink2URL: https://datasheet.ciiva.com/11821/0900766b80f80784-11821229.pdf?src-supplier=Rs; ComponentLink2Description: https://datasheet.ciiva.com/11821/0900766b80f80784-11821229.pdf?src-supplier=Rs; ComponentLink3URL: https://datasheet.ciiva.com/7909/aoa0000ce2-7909180.pdf?src-supplier=Element14; ComponentLink3Description: https://datasheet.ciiva.com/7909/aoa0000ce2-7909180.pdf?src-supplier=Element14; ComponentLink4URL: https://datasheet.ciiva.com/22723/1678782-22723164.pdf?src-supplier=Element14; ComponentLink4Description: https://datasheet.ciiva.com/22723/1678782-22723164.pdf?src-supplier=Element14; ComponentLink5URL: https://datasheet.ciiva.com/24158/aoa0000ce2-24158990.pdf?src-supplier=Mouser; ComponentLink5Description: https://datasheet.ciiva.com/24158/aoa0000ce2-24158990.pdf?src-supplier=Mouser; ComponentLink6URL: https://datasheet.ciiva.com/16766/70260748-16766711.pdf?src-supplier=Allied+Electronics; ComponentLink6Description: https://datasheet.ciiva.com/16766/70260748-16766711.pdf?src-supplier=Allied+Electronics; ComponentLink7URL: https://datasheet.ciiva.com/16779/70260748-16779288.pdf?src-supplier=Allied+Electronics; ComponentLink7Description: https://datasheet.ciiva.com/16779/70260748-16779288.pdf?src-supplier=Allied+Electronics; ComponentLink8URL: https://datasheet.ciiva.com/16199/aoa0000ce2-16199544.pdf?src-supplier=Future+Electronics; ComponentLink8Description: https://datasheet.ciiva.com/16199/aoa0000ce2-16199544.pdf?src-supplier=Future+Electronics; Supplier: Digi-Key